# Altium schematic sheet COMUNICATE_CON.SchDoc
size A; SheetNumber: 8; SheetTotal: 10
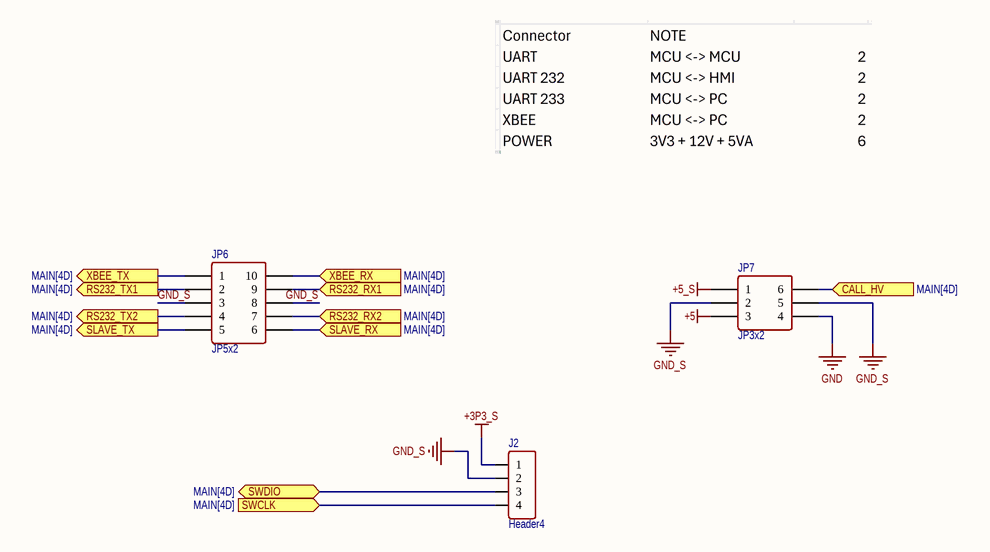
[diagram p0: COMUNICATE_CON.SchDoc]

## Parts
J2  Header4  [XH2.54-4-DIP]
JP6  JP5x2  [JP5-D2T]
JP7  JP3x2  [JP3-C2T]

## Ports
CALL_HV (in, see MAIN[4D]), RS232_RX1 (in, see MAIN[4D]), RS232_RX2 (in, see MAIN[4D]), RS232_TX1 (out, see MAIN[4D]), RS232_TX2 (out, see MAIN[4D]), SLAVE_RX (in, see MAIN[4D]), SLAVE_TX (out, see MAIN[4D]), SWCLK (in, see MAIN[4D]), SWDIO (bidir, see MAIN[4D]), XBEE_RX (in, see MAIN[4D]), XBEE_TX (out, see MAIN[4D])

## Nets
+3P3_S: J2.1
+5: JP7.3
+5_S: JP7.1
GND: JP7.4
GND_S: J2.2 JP6.3 JP6.8 JP7.2 JP7.5
CALL_HV: JP7.6 ; port CALL_HV
RS232_RX1: JP6.9 ; port RS232_RX1
RS232_RX2: JP6.7 ; port RS232_RX2
RS232_TX1: JP6.2 ; port RS232_TX1
RS232_TX2: JP6.4 ; port RS232_TX2
SLAVE_RX: JP6.6 ; port SLAVE_RX
SLAVE_TX: JP6.5 ; port SLAVE_TX
SWCLK: J2.4 ; port SWCLK
SWDIO: J2.3 ; port SWDIO
XBEE_RX: JP6.10 ; port XBEE_RX
XBEE_TX: JP6.1 ; port XBEE_TX

## Library data of the parts
J2 = Header4: Connector 4; Manufacturer: W¨¹rth Elektronik eiSos GmbH; partNo: 613002143121; ComponentLink1 Description: Manufacturer; ComponentLink2 Description: Datasheet; NoPins: 02; Created Date: 29 March 2013; ComponentLink1URL: http://www.we-online.com; ComponentLink2URL: http://katalog.we-online.de/em/datasheet/6130xx143121.pdf; Created by: Karrer Zheng
JP6 = JP5x2: WR-PHD 2.54 mm Dual Socket Header; Manufacturer: W¨¹rth Elektronik eiSos GmbH; partNo: 61301021821; ComponentLink1 Description: Manufacturer; ComponentLink2 Description: Datasheet; NoPins: 10; Created Date: 29 March 2013; ComponentLink1URL: http://www.we-online.com; ComponentLink2URL: http://katalog.we-online.de/em/datasheet/6130xx21821.pdf; Created by: Karrer Zheng
JP7 = JP3x2: 5-534206-3; Manufacturer: W¨¹rth Elektronik eiSos GmbH; partNo: 61300621821; ComponentLink1 Description: Manufacturer; ComponentLink2 Description: Datasheet; NoPins: 06; Created Date: 29 March 2013; ComponentLink1URL: http://www.we-online.com; ComponentLink2URL: http://katalog.we-online.de/em/datasheet/6130xx21821.pdf; Created by: Karrer Zheng